# Altium schematic sheet RP5_Right_Flex.SchDoc
size A4; SheetNumber: 1; SheetTotal: 1; ENG_APP_DATE: --/--/--; DSN_APP_DATE: --/--/--; CHK_APP_DATE: --/--/--
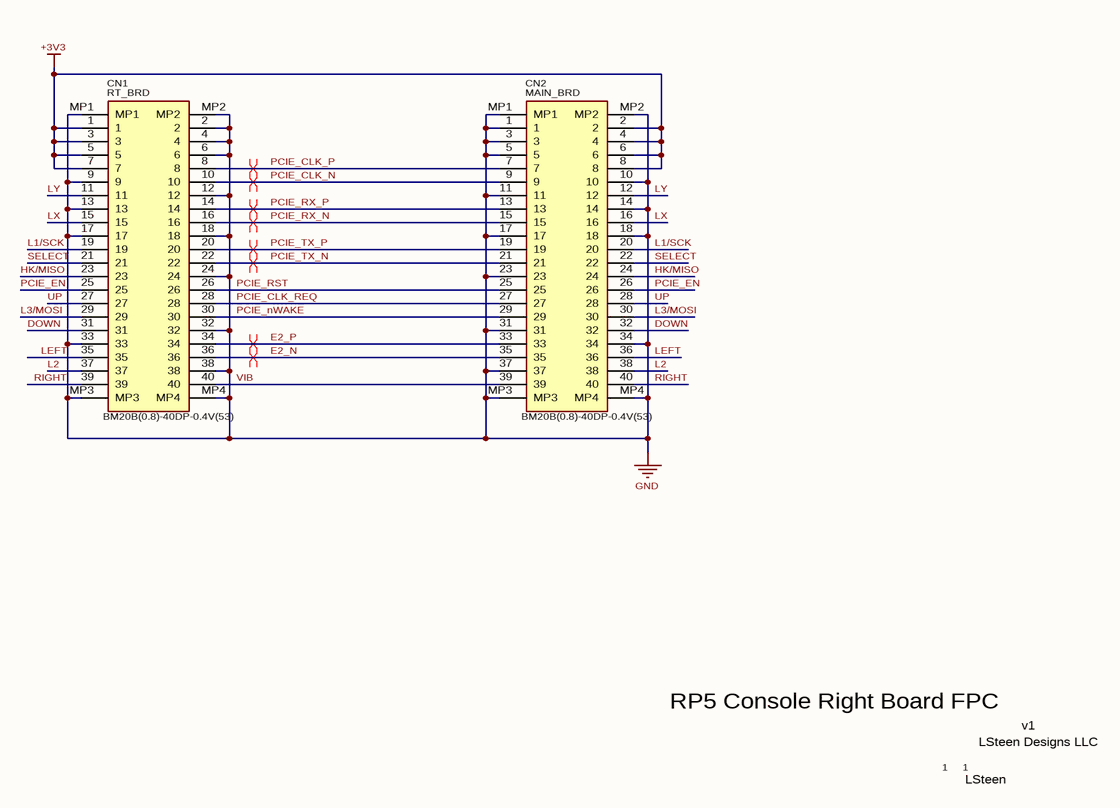
[diagram p0: RP5_Right_Flex.SchDoc]

## Parts
CN1  RT_BRD  [BM20B0840DP04V53]
CN2  MAIN_BRD  [BM20B0840DP04V53]

## Nets
+3V3: CN1.1 CN1.3 CN1.5 CN1.7 CN2.2 CN2.4 CN2.6 CN2.8
GND: CN1.2 CN1.4 CN1.6 CN1.9 CN1.12 CN1.13 CN1.17 CN1.18 CN1.24 CN1.32 CN1.33 CN1.38 CN1.MP1 CN1.MP2 CN1.MP3 CN1.MP4 CN2.1 CN2.3 CN2.5 CN2.10 CN2.11 CN2.14 CN2.17 CN2.18 CN2.23 CN2.31 CN2.34 CN2.37 CN2.MP1 CN2.MP2 CN2.MP3 CN2.MP4
DOWN: CN1.31 CN2.32
E2_N: CN1.36 CN2.35
E2_P: CN1.34 CN2.33
HK/MISO: CN1.23 CN2.24
L1/SCK: CN1.19 CN2.20
L2: CN1.37 CN2.38
L3/MOSI: CN1.29 CN2.30
LEFT: CN1.35 CN2.36
LX: CN1.15 CN2.16
LY: CN1.11 CN2.12
PCIE_CLK_N: CN1.10 CN2.9
PCIE_CLK_P: CN1.8 CN2.7
PCIE_CLK_REQ: CN1.28 CN2.27
PCIE_EN: CN1.25 CN2.26
PCIE_nWAKE: CN1.30 CN2.29
PCIE_RST: CN1.26 CN2.25
PCIE_RX_N: CN1.16 CN2.15
PCIE_RX_P: CN1.14 CN2.13
PCIE_TX_N: CN1.22 CN2.21
PCIE_TX_P: CN1.20 CN2.19
RIGHT: CN1.39 CN2.40
SELECT: CN1.21 CN2.22
UP: CN1.27 CN2.28
VIB: CN1.40 CN2.39

## Layout directives
differential pair; differential pair class PCIe Gen 3x1: PCIE_CLK_N, PCIE_CLK_P, PCIE_RX_N, PCIE_RX_P, PCIE_TX_N, PCIE_TX_P
differential pair; differential pair class USB 2.0: E2_N, E2_P

## Notes on the sheet
- (near CN1) BM20B(0.8)-40DP-0.4V(53)
- (near CN2) BM20B(0.8)-40DP-0.4V(53)
- RP5 Console Right Board FPC
- 1
- LSteen Designs LLC
- v1
- LSteen
- DWG. NO.
- REV.
- SHT.
- THIS DOCUMENT AND THE DATA DISCLOSED HEREIN OR HEREWITH IS THE PROPERTY OF ALTIUM LIMITED AND MAY BE FREELY DISTRIBUTED IN WHOLE. NO RIGHTS ARE RESERVED OR EXPRESS OR IMPLIED WARANTEE GIVEN.
- REVISION
- DESCRIPTION
- DATE
- APPROVED
- ENG:
- APPROVALS
- PROJECT
- DSN:
- CHK:
- REFERENCE DOCUMENTS
- PROJECT REVISION:
- TITLE
- DOCUMENT REVISION:
- DESIGN ITEM:
- BOM:
- FAB DWG:
- PCB DWG:
- ASSY DWG:
- SCALE:
- SIZE
- B
- CAGE CODE
- FILE NAME
- DWG NO.
- SHEET
- OF
- REV

## Library data of the parts
CN1 CN2 = BM20B(0.8)-40DP-0.4V(53): Connector; Manufacturer_Name: Hirose; Manufacturer_Part_Number: BM20B(0.8)-40DP-0.4V(51); Datasheet Link: https://www.hirose.com/en/product/document?clcode=CL0684-9005-6-51&productname=BM20B(0.8)-40DP-0.4V(51)&series=BM20&documenttype=2DDrawing&lang=en&documentid=0000948948; Height: 0.76mm; Supplier 1: Mouser; Supplier Part Number 1: 798-BM20B0840DP04V53; System: Connector